# EAGLE design ds-8_clone_V3.0 (EAGLE 5.10)
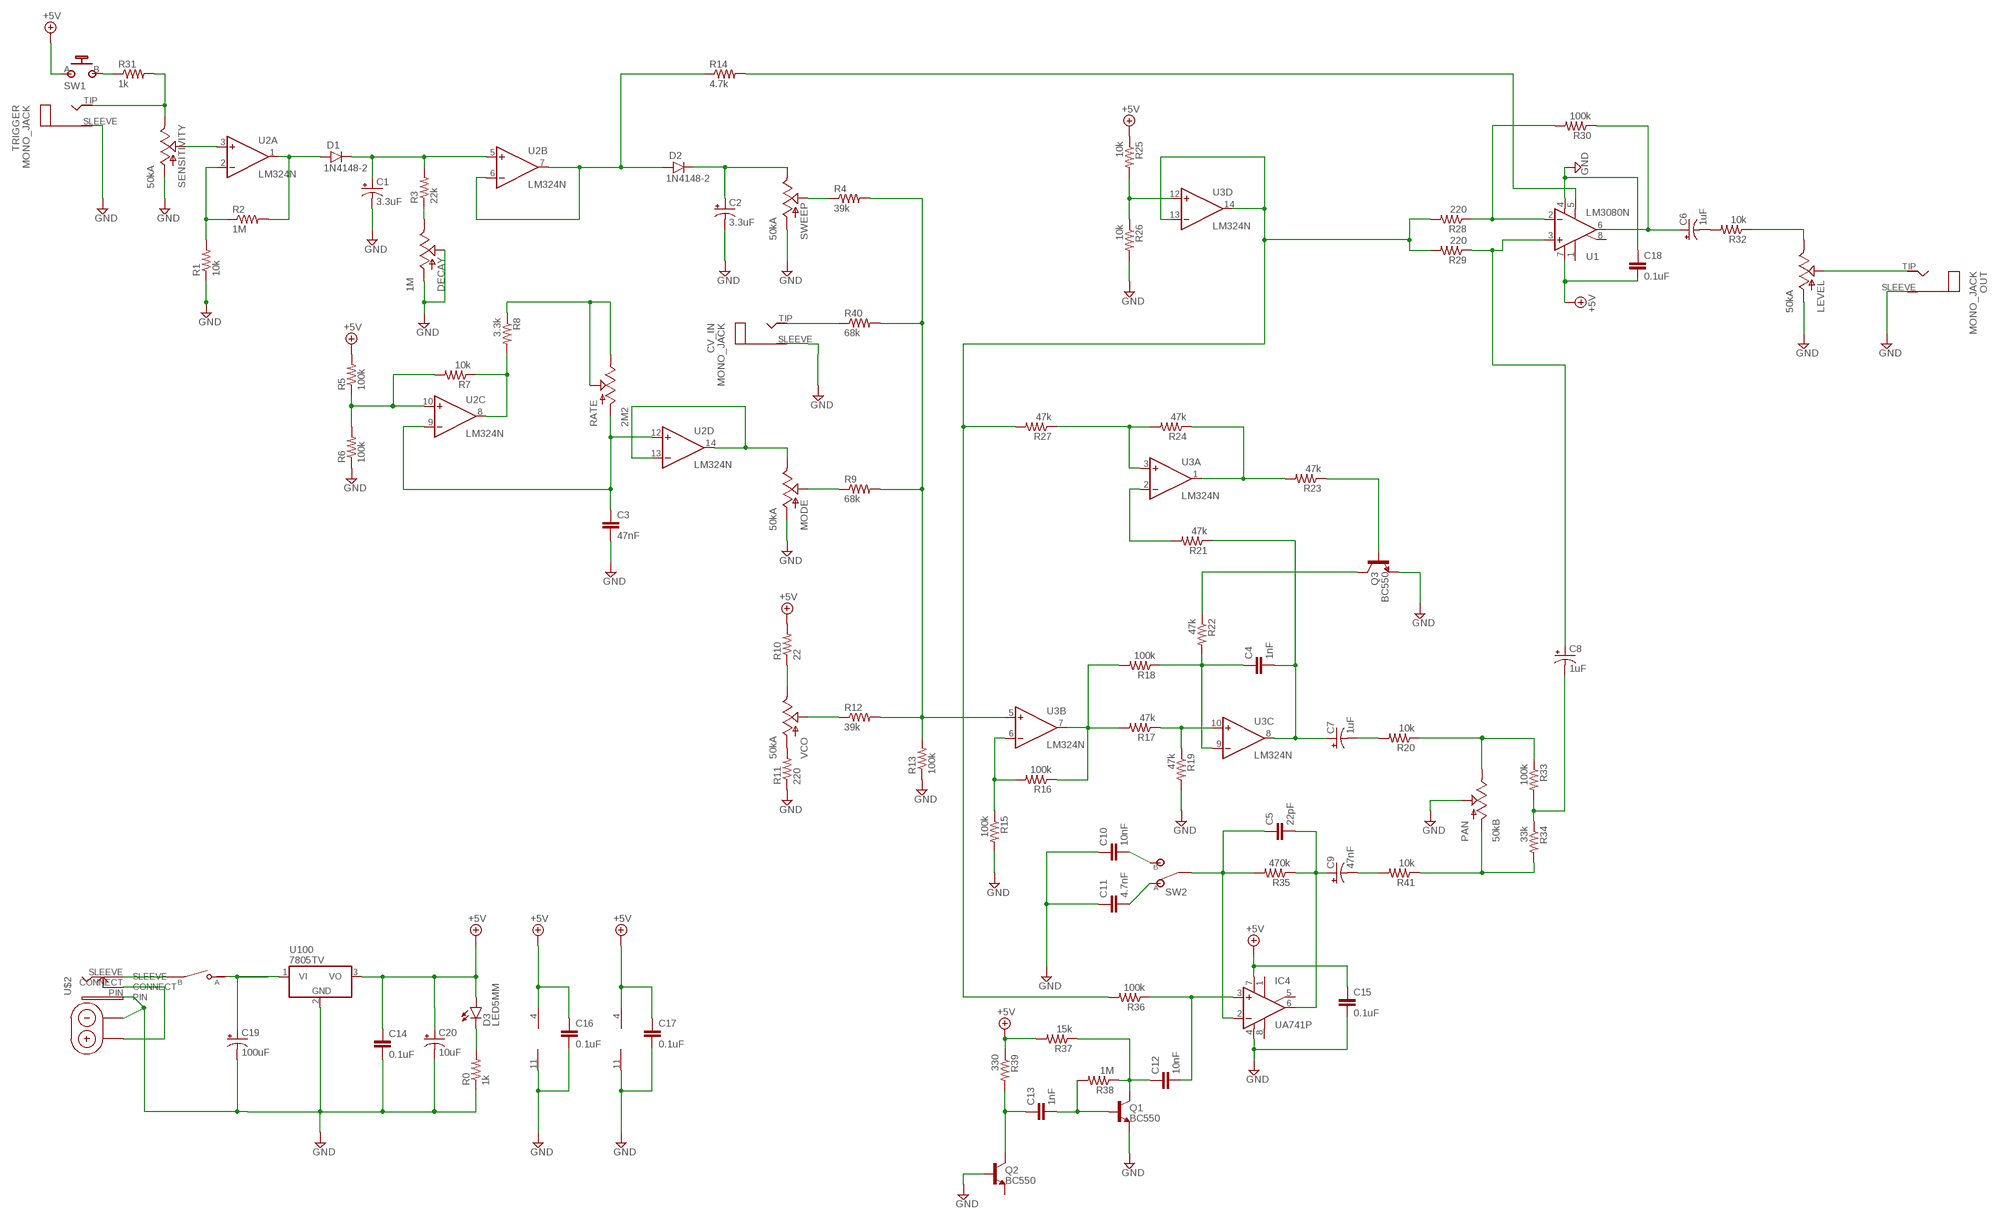
[diagram p0: schematic, sheet 1]

## Parts
C1  3.3uF  0501  [050_020_1]
C2  3.3uF  0501  [050_020_1]
C3  47nF  CERAMIC_CAPACITOR  [CERAMIC_CAP]
C4  1nF  CERAMIC_CAPACITOR  [CERAMIC_CAP]
C5  22pF  CERAMIC_CAPACITOR  [CERAMIC_CAP]
C6  1uF  0501  [050_020_1]
C7  1uF  0501  [050_020_1]
C8  1uF  0501  [050_020_1]
C9  47nF  0501  [050_020_1]
C10  10nF  CERAMIC_CAPACITOR  [CERAMIC_CAP]
C11  4.7nF  CERAMIC_CAPACITOR  [CERAMIC_CAP]
C12  10nF  CERAMIC_CAPACITOR  [CERAMIC_CAP]
C13  1nF  CERAMIC_CAPACITOR  [CERAMIC_CAP]
C14  0.1uF  CERAMIC_CAPACITOR  [CERAMIC_CAP]
C15  0.1uF  CERAMIC_CAPACITOR  [CERAMIC_CAP]
C16  0.1uF  CERAMIC_CAPACITOR  [CERAMIC_CAP]
C17  0.1uF  CERAMIC_CAPACITOR  [CERAMIC_CAP]
C18  0.1uF  CERAMIC_CAPACITOR  [CERAMIC_CAP]
C19  100uF  0501  [050_020_1]
C20  10uF  0501  [050_020_1]
CV_IN  MONO_JACK  [MONO_JACK]
D1  1N4148-2  [DO35-2]
D2  1N4148-2  [DO35-2]
D3  LED5MM  [LED5MM]
DECAY  1M  POT-RV16AF-20  [POT_ALPHA_RV16AF-20]
IC4  UA741P  [DIL08]
LEVEL  50kA  POT-RV16AF-20  [POT_ALPHA_RV16AF-20]
MODE  50kA  POT-RV16AF-20  [POT_ALPHA_RV16AF-20]
OUT  MONO_JACK  [MONO_JACK]
PAN  50kB  POT-RV16AF-20  [POT_ALPHA_RV16AF-20]
Q1  BC550  [TO92-]
Q2  BC550  [TO92-]
Q3  BC550  [TO92-]
R0  1k  RESISTOR  [RESISTOR]
R1  10k  RESISTOR  [RESISTOR]
R2  1M  RESISTOR  [RESISTOR]
R3  22k  RESISTOR  [RESISTOR]
R4  39k  RESISTOR  [RESISTOR]
R5  100k  RESISTOR  [RESISTOR]
R6  100k  RESISTOR  [RESISTOR]
R7  10k  RESISTOR  [RESISTOR]
R8  3.3k  RESISTOR  [RESISTOR]
R9  68k  RESISTOR  [RESISTOR]
R10  22  RESISTOR  [RESISTOR]
R11  220  RESISTOR  [RESISTOR]
R12  39k  RESISTOR  [RESISTOR]
R13  100k  RESISTOR  [RESISTOR]
R14  4.7k  RESISTOR  [RESISTOR]
R15  100k  RESISTOR  [RESISTOR]
R16  100k  RESISTOR  [RESISTOR]
R17  47k  RESISTOR  [RESISTOR]
R18  100k  RESISTOR  [RESISTOR]
R19  47k  RESISTOR  [RESISTOR]
R20  10k  RESISTOR  [RESISTOR]
R21  47k  RESISTOR  [RESISTOR]
R22  47k  RESISTOR  [RESISTOR]
R23  47k  RESISTOR  [RESISTOR]
R24  47k  RESISTOR  [RESISTOR]
R25  10k  RESISTOR  [RESISTOR]
R26  10k  RESISTOR  [RESISTOR]
R27  47k  RESISTOR  [RESISTOR]
R28  220  RESISTOR  [RESISTOR]
R29  220  RESISTOR  [RESISTOR]
R30  100k  RESISTOR  [RESISTOR]
R31  1k  RESISTOR  [RESISTOR]
R32  10k  RESISTOR  [RESISTOR]
R33  100k  RESISTOR  [RESISTOR]
R34  33k  RESISTOR  [RESISTOR]
R35  470k  RESISTOR  [RESISTOR]
R36  100k  RESISTOR  [RESISTOR]
R37  15k  RESISTOR  [RESISTOR]
R38  1M  RESISTOR  [RESISTOR]
R39  330  RESISTOR  [RESISTOR]
R40  68k  RESISTOR  [RESISTOR]
R41  10k  RESISTOR  [RESISTOR]
RATE  2M2  POT-RV16AF-20  [POT_ALPHA_RV16AF-20]
SENSITIVITY  50kA  POT-RV16AF-20  [POT_ALPHA_RV16AF-20]
SW1  MOMENTARY_SW  [MOMENTARY_SW]
SW2  SPDT_SWITCH  [SPDT_TOGGLE_SWITCH]
SW3  SPST_SWITCH  [SPST_TOGGLE_SWITCH]
SWEEP  50kA  POT-RV16AF-20  [POT_ALPHA_RV16AF-20]
TRIGGER  MONO_JACK  [MONO_JACK]
U1  LM3080N  [DIL08]
U2  LM324N  [DIL14]
U3  LM324N  [DIL14]
U100  7805TV  [TO220V]
U$1  9V_BATTERY_CLIP  [9V_BATTERY]
U$2  DC_JACK_OFFBOARD  [DC_JACK_OFFBOARD]
VCO  50kA  POT-RV16AF-20  [POT_ALPHA_RV16AF-20]

## Nets
+9V: C14.1 C15.1 C16.1 C17.1 C18.2 C20.+ D3.A IC4.7(V+) R5.2 R10.2 R25.1 R37.2 R39.1 SW1.A(P) U1.7(V+) U2.4(P:V+) U3.4(P:V+) U100.3(VO) ; supply symbol labelled +5V
C5: C5.1 IC4.2(-IN) R35.2 SW2.C(COM)
GND: C1.- C2.- C3.2 C10.1 C11.1 C14.2 C15.2 C16.2 C17.2 C18.1 C19.- C20.- CV_IN.SLEEVE DECAY.1(A) DECAY.2(S) IC4.4(V-) LEVEL.1(A) MODE.1(A) OUT.SLEEVE PAN.2(S) Q1.1(E) Q2.2(B) Q3.1(E) R0.1 R1.1 R6.1 R11.1 R13.1 R15.2 R19.2 R26.2 SENSITIVITY.1(A) SWEEP.1(A) TRIGGER.SLEEVE U1.4(V-) U2.11(P:V-) U3.11(P:V-) U100.2(GND) U$1.9V_BATTERY_- U$2.PIN
N$1: R31.2 SENSITIVITY.3(E) TRIGGER.TIP
N$2: SW3.B U$2.SLEEVE
N$3: SENSITIVITY.2(S) U2.3(A:+IN)
N$4: R31.1 SW1.B(S)
N$5: R1.2 R2.1 U2.2(A:-IN)
N$6: D1.A R2.2 U2.1(A:OUT)
N$7: C1.+ D1.C R3.2 U2.5(B:+IN)
N$8: D2.A R14.1 U2.6(B:-IN) U2.7(B:OUT)
N$9: DECAY.3(E) R3.1
N$10: U$1.9V_BATTERY_+ U$2.CONNECT
N$11: R14.2 U1.5(OPT)
N$12: R4.1 SWEEP.2(S)
N$13: R25.2 R26.1 U3.12(D:+IN)
N$14: R28.1 R30.2 U1.2(-IN)
N$15: C8.+ R29.1 U1.3(+IN)
N$16: R27.2 R28.2 R29.2 R36.2 U3.13(D:-IN) U3.14(D:OUT)
N$17: CV_IN.TIP R40.1
N$18: C6.+ R30.1 U1.6(OUT)
N$19: R4.2 R9.2 R12.2 R13.2 R40.2 U3.5(B:+IN)
N$20: MODE.2(S) R9.1
N$21: R11.2 VCO.1(A)
N$22: R12.1 VCO.2(S)
N$23: C2.+ D2.C SWEEP.3(E)
N$24: R5.1 R6.2 R7.2 U2.10(C:+IN)
N$25: LEVEL.3(E) R32.1
N$26: R7.1 R8.2 U2.8(C:OUT)
N$27: LEVEL.2(S) OUT.TIP
N$28: R10.1 VCO.3(E)
N$29: R15.1 R16.2 U3.6(B:-IN)
N$30: R16.1 R17.2 R18.2 U3.7(B:OUT)
N$31: R17.1 R19.1 U3.10(C:+IN)
N$32: C4.1 R18.1 R22.2 U3.9(C:-IN)
N$33: C4.2 C7.+ R21.1 U3.8(C:OUT)
N$34: C7.- R20.2
N$35: PAN.3(E) R20.1 R33.1
N$36: C8.- R33.2 R34.1
N$37: MODE.3(E) U2.13(D:-IN) U2.14(D:OUT)
N$38: C9.- R41.2
N$39: C5.2 C9.+ IC4.6(OUT) R35.1
N$40: D3.K(C) R0.2
N$41: C10.2 SW2.B
N$42: C12.2 IC4.3(+IN) R36.1
N$43: C11.2 SW2.A
N$44: C12.1 Q1.3(C) R37.1 R38.1
N$45: C19.+ SW3.A U100.1(VI)
N$46: C13.2 Q1.2(B) R38.2
N$47: C13.1 Q2.3(C) R39.2
N$48: Q3.3(C) R22.1
N$49: R21.2 U3.2(A:-IN)
N$50: Q3.2(B) R23.1
N$51: R23.2 R24.1 U3.1(A:OUT)
N$52: R24.2 R27.1 U3.3(A:+IN)
N$53: C6.- R32.2
N$55: R8.1 RATE.2(S) RATE.3(E)
N$56: C3.1 RATE.1(A) U2.9(C:-IN) U2.12(D:+IN)
R34: PAN.1(A) R34.2 R41.1
Unconnected: IC4.1(ON1) IC4.5(ON2) IC4.8(OPT) Q2.1(E) U1.1(ON1) U1.8(ON2)

## Library data of the parts
C1 C2 C6-C9 C19 C20 = gm-caps-electro-pol:050: 0.22 - 100uF Xicon values at Mouser.com: 10V: 10 - 100uF; 16V: 2.2 - 47uF; 25V: 0.47 - 47uF; 50V: 0.22 - 22uF
C3-C5 C10-C18 = 00_steve:CERAMIC_CAPACITOR
CV_IN OUT TRIGGER = 00_steve:MONO_JACK
D1 D2 = gm-diodes:1N4148: Fast Switching Diode DO-35 glass case a.k.a. 1N914
D3 = gm-diodes:LED
DECAY LEVEL MODE PAN RATE SENSITIVITY SWEEP VCO = SparkFun:POT
IC4 = linear:*741: OP AMP
Q1-Q3 = gm-trans:BC550
R0 R1-R41 = 00_steve:RESISTOR
SW1 = 00_steve:MOMENTARY_SW
SW2 = 00_steve:SPDT_SWITCH: SPDT Switch Part No.: M102 Source: (http://www.led-switch.com)
SW3 = 00_steve:SPST_SWITCH: SPST Switch Part No.: M101 Source: (http://www.led-switch.com)
U1 = gm-ics:*3080: OP AMP
U2 U3 = linear:LM324: OP AMP
U100 = linear:78*: Positive VOLTAGE REGULATOR Source: http://cache.national.com/ds/LM/LM78L05.pdf http://www.fairchildsemi.com/ds/LM/LM7805.pdf
U$1 = 00_steve:9V_BATTERY_CLIP
U$2 = 00_steve:DC_JACK_OFFBOARD

## Board
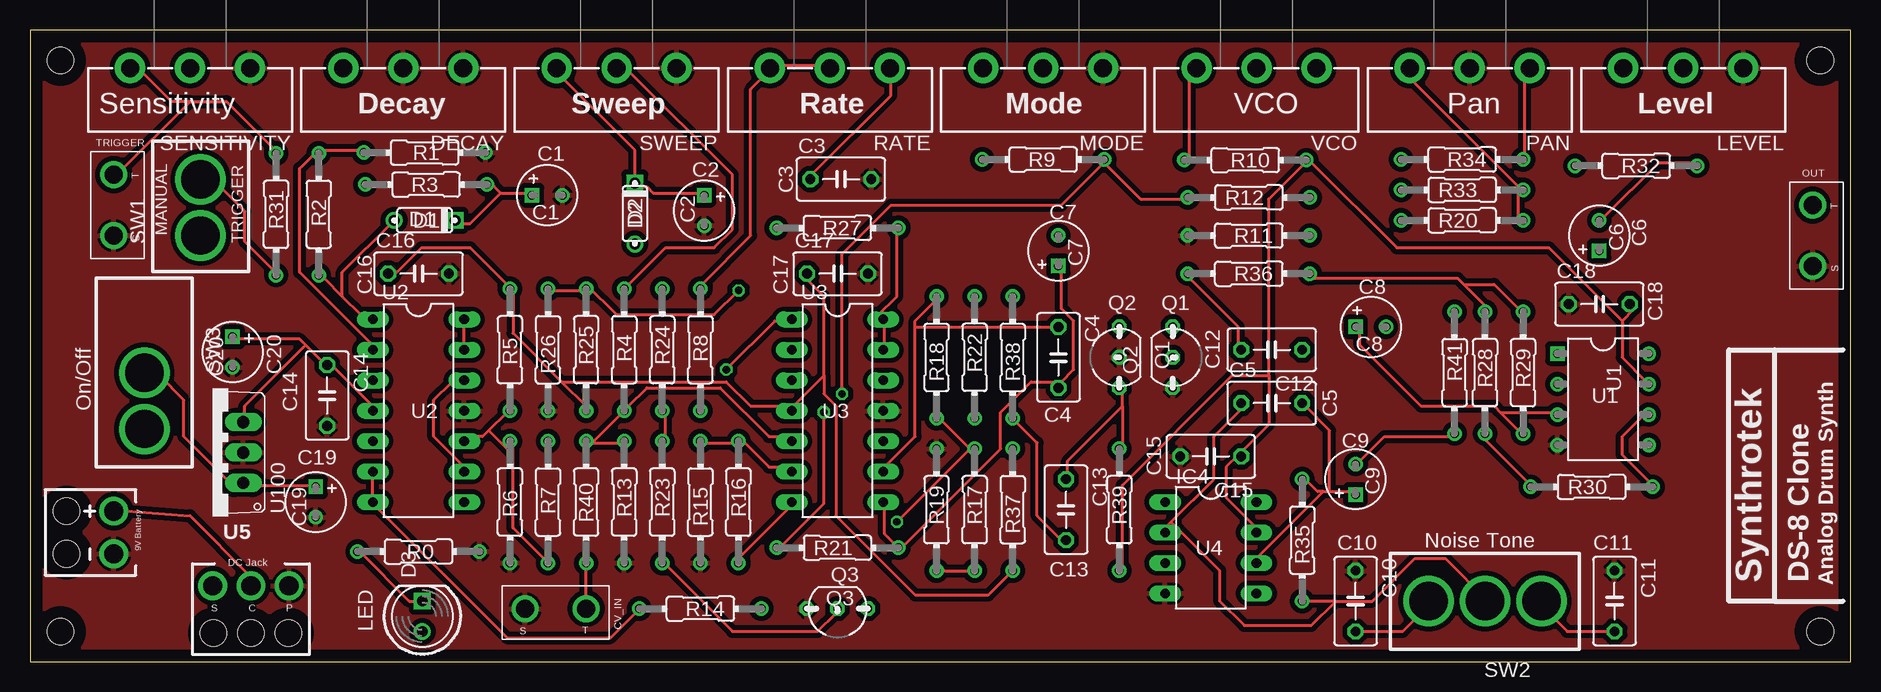
[diagram p1: board, top side]
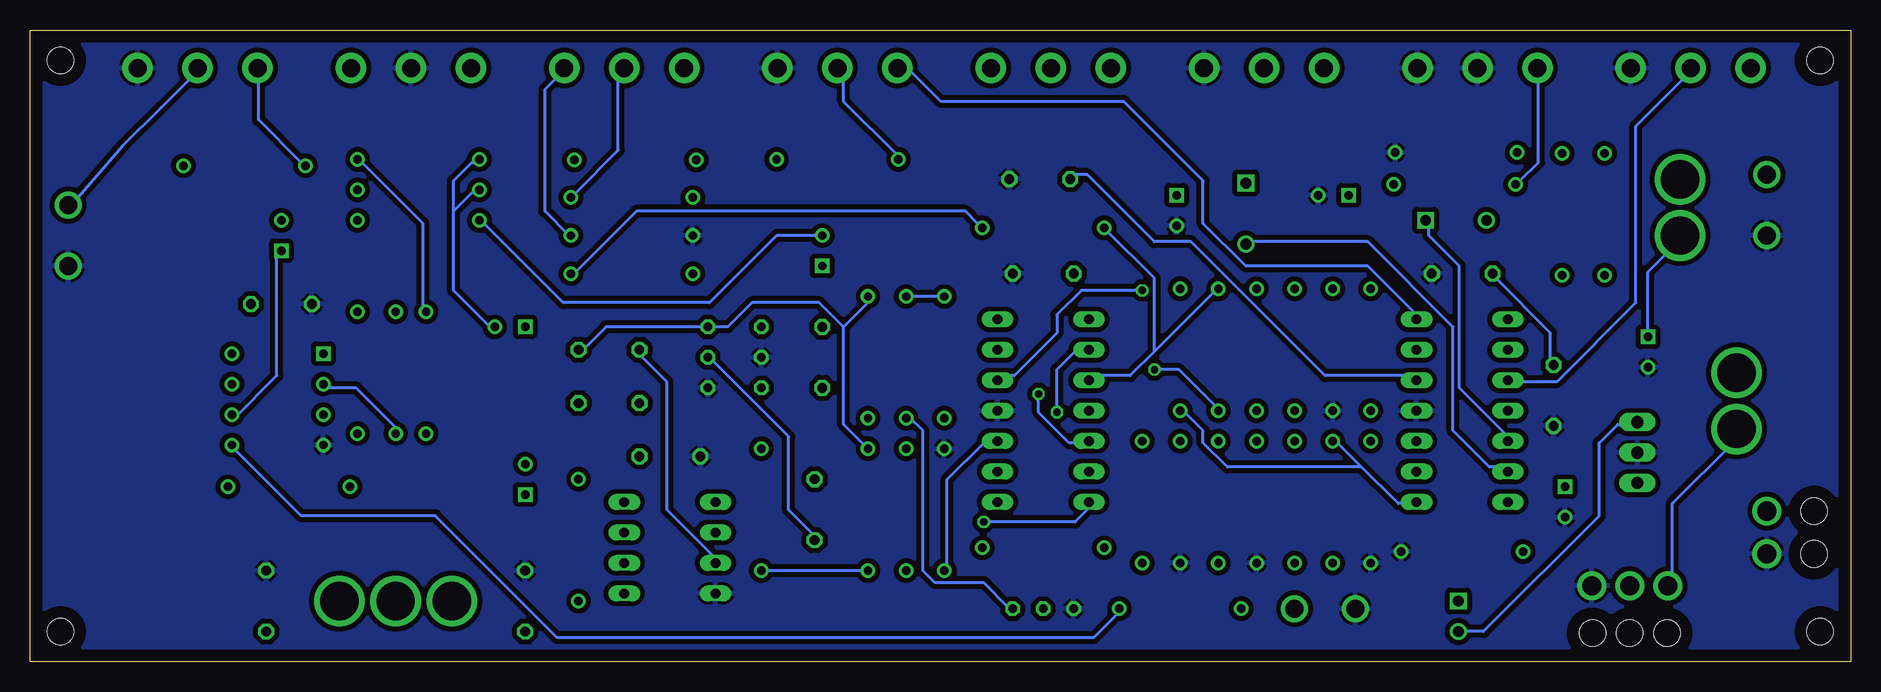
[diagram p2: board, bottom side, seen from below]

Size 151.77 x 52.7 mm. Coordinates in mm from the lower left corner, seen from the top.
Outline: 0,0 151.77,0 151.77,52.7 0,52.7 0,0
Copper layers (1*16): Top 0.035mm / dielectric 1.5mm / Bottom 0.035mm
Design rules "default": minimum track width 10mil, minimum drill 24mil, track to track 8mil, track to pad 8mil, pad to pad 8mil, via to via 8mil, smd to smd 8mil, copper to edge 40mil, drill to drill 8mil, minimum pad ring 10mil, minimum via ring 8mil, stop-mask expansion 4mil, vias tented up to drill 0mil, thermal gap 10mil
Holes 2.2 mm at 2.54,50.16 149.23,50.16 2.54,2.54 149.23,2.54

### Footprints (pad centres in the part's own frame; a part is rotated, then mirrored left to right if it is on the bottom)
050_020_1 = drill 0.7 square: + -1.27,0 | drill 0.7 round: - 1.27,0
CERAMIC_CAP = drill 0.813 octagon: 1 -2.54,0; 2 2.54,0
MONO_JACK = drill 1.5 round: SLEEVE 2.54,0; TIP -2.54,0
DO35-2 = drill 0.9 round: A 2.54,0 | drill 0.9 square: C -2.54,0
LED5MM = drill 0.9 round: A -1.27,0 | drill 0.9 square: K 1.27,0
POT_ALPHA_RV16AF-20 = drill 1.5 pad 2.54 round: 1 -5,0; 2 0,0; 3 5,0
DIL08 = drill 0.813 long: 1 -3.81,-3.81; 2 -1.27,-3.81; 3 1.27,-3.81; 4 3.81,-3.81; 5 3.81,3.81; 6 1.27,3.81; 7 -1.27,3.81; 8 -3.81,3.81
TO92- = drill 0.7 octagon: 1 2.54,0; 2 0,0; 3 -2.54,0
RESISTOR = drill 0.7 round: 1 -5.08,0; 2 5.08,0
MOMENTARY_SW = drill 3.2 round: A -2.223,0.064; B 2.478,0.064
SPDT_TOGGLE_SWITCH = drill 3.2 round: A -4.7,0; B 4.7,0; C 0,0
SPST_TOGGLE_SWITCH = drill 3.2 round: A 0,0; B 4.7,0
DIL08' = drill 0.7 square: 1 -3.81,-3.81 | drill 0.7 round: 2 -1.27,-3.81; 3 1.27,-3.81; 4 3.81,-3.81; 5 3.81,3.81; 6 1.27,3.81; 7 -1.27,3.81; 8 -3.81,3.81
DIL14 = drill 0.813 long: 1 -7.62,-3.81; 2 -5.08,-3.81; 3 -2.54,-3.81; 4 0,-3.81; 5 2.54,-3.81; 6 5.08,-3.81; 7 7.62,-3.81; 8 7.62,3.81; 9 5.08,3.81; 10 2.54,3.81; 11 0,3.81; 12 -2.54,3.81; 13 -5.08,3.81; 14 -7.62,3.81
TO220V = drill 1.016 long: 1 -2.54,-2.54; 2 0,-2.54; 3 2.54,-2.54
9V_BATTERY = drill 1.6 round: 9V_BATTERY_+ -1.778,1.27; 9V_BATTERY_- 1.778,1.27 | hole 2.2: -1.778,-2.667; 1.778,-2.667
DC_JACK_OFFBOARD = drill 1.6 round: CONNECT 0,1.27; PIN 3.175,1.27; SLEEVE -3.175,1.27 | hole 2.2: -3.111,-2.667; 0,-2.667; 3.111,-2.667

### Placement (x,y rotation side)
C1  43.12,38.93 0 top
C2  56.2,37.66 270 top
C3  67.59,40.26 0 top
C4  85.72,25.4 270 top
C5  103.5,21.59 0 top
C6  130.81,35.56 90 top
C7  85.72,34.29 90 top
C8  111.76,27.94 0 top
C9  110.49,15.24 90 top
C10  110.49,5.08 270 top
C11  132.08,5.08 270 top
C12  103.5,26.04 180 top
C13  86.36,12.7 270 top
C14  24.77,22.23 270 top
C15  98.42,17.14 180 top
C16  32.38,32.38 0 top
C17  67.31,32.38 0 top
C18  130.81,29.84 0 top
C19  23.81,13.34 270 top
C20  16.89,25.84 270 top
CV_IN  43.81,4.45 180 top
D1  32.89,36.83 180 top
D2  50.42,37.4 270 top
D3  32.7,3.81 90 top
DECAY  31.12,49.53 180 top
IC4  98.42,9.53 270 top
LEVEL  137.8,49.53 180 top
MODE  84.45,49.53 180 top
OUT  148.59,35.56 270 top
PAN  120.02,49.53 180 top
Q1  95.25,25.4 270 top
Q2  90.8,25.4 90 top
Q3  67.31,4.45 180 top
R0  32.38,9.21 180 top
R1  32.89,42.48 180 top
R2  24.07,37.34 270 top
R3  33.02,39.81 0 top
R4  49.53,26.04 270 top
R5  40,26.04 90 top
R6  40,13.34 90 top
R7  43.18,13.34 270 top
R8  55.88,26.04 270 top
R9  84.45,41.91 0 top
R10  101.31,41.86 0 top
R11  101.6,35.56 0 top
R12  101.6,38.73 180 top
R13  49.53,13.34 90 top
R14  55.88,4.45 0 top
R15  55.88,13.34 270 top
R16  59.05,13.34 90 top
R17  78.74,12.7 90 top
R18  75.56,25.4 270 top
R19  75.56,12.7 90 top
R20  119.38,36.83 180 top
R21  67.31,9.53 180 top
R22  78.74,25.4 90 top
R23  52.7,13.34 90 top
R24  52.7,26.04 90 top
R25  46.35,26.04 90 top
R26  43.18,26.04 270 top
R27  67.31,36.2 0 top
R28  121.28,24.13 90 top
R29  124.46,24.13 90 top
R30  130.18,14.61 180 top
R31  20.51,37.34 90 top
R32  133.89,41.38 0 top
R33  119.38,39.37 180 top
R34  119.38,41.91 0 top
R35  106.05,10.16 270 top
R36  101.6,32.38 0 top
R37  81.91,12.7 270 top
R38  81.91,25.4 270 top
R39  90.8,12.7 90 top
R40  46.35,13.34 90 top
R41  118.74,24.13 270 top
RATE  66.67,49.53 180 top
SENSITIVITY  13.34,49.53 180 top
SW1  14.29,37.78 90 top
SW2  121.28,5.08 180 top
SW3  9.52,24.13 270 top
SWEEP  48.89,49.53 180 top
TRIGGER  6.98,38.1 270 top
U1  LM3080N  [DIL08']  131.13,21.91 270 top
U2  32.38,20.95 270 top
U3  67.31,20.95 270 top
U100  15.24,17.46 90 top
U$1  5.71,10.79 270 top
U$2  18.41,5.08 0 top
VCO  102.23,49.53 180 top

### Tracks (layer width: path | path; a pad name or v marks a point on that pad's centre or on a via)
+9V
  Top 0.254: 132.72,28.45 132.72,25.4 134.75,23.37 U1.7 | 132.72,28.45 133.73,29.46 C18.2 | 103.25,23.88 103.25,19.81 100.71,17.27 | 103.25,23.88 103.25,38.61 106.3,41.66 R10.2 106.81,41.66 113.92,34.54 126.62,34.54 132.72,28.45 | 100.71,17.27 C15.1 100.71,17.27 | 100.71,17.27 99.69,16.26 99.69,13.72 102.23,11.18 IC4.7 | 103.25,23.88 100.2,23.88 91.06,14.73 91.06,7.62 R39.1 | 66.17,23.88 63.63,21.34 U3.4 63.12,21.34 60.07,21.34 58.04,23.37 44.32,23.37 | 66.17,23.88 66.17,30.48 64.64,32 C17.1 | C16.1 30.1,32 32.64,34.54 36.7,34.54 39.75,31.5 R5.2 40.26,30.99 40.26,27.43 44.32,23.37 | 44.32,23.37 46.35,21.34 R25.1 | U2.4 28.57,21.34 25.02,24.89 C14.1 24.51,24.89 22.99,26.42 | 22.99,26.42 22.48,26.92 16.89,26.92 C20.+ | 22.99,26.42 17.91,21.34 17.91,20.32 U100.3 | R37.2 79.88,5.59 73.79,5.59 67.18,12.19 67.18,21.34 66.17,22.35 66.17,23.88
  Bottom 0.254: R37.2 90.55,7.62 R39.1 | D3.A 32.64,2.54 30.61,2.54 20.96,12.19 20.96,18.29 19.43,19.81 17.91,19.81 U100.3 | C20.+ 16.89,27.43 16.89,32.51 13.84,35.56 SW1.A | C16.1 29.59,32 25.02,27.43 25.02,24.89 C14.1
C5
  Top 0.254: 95.12,11.68 98.68,15.24 98.68,18.8 101.22,21.34 C5.1 | 95.12,11.68 94.61,11.18 IC4.2 | 108.84,5.08 111.89,5.08 115.44,8.64 117.98,8.64 121.54,5.08 SW2.C | 108.84,5.08 106.3,5.08 R35.2 | 95.12,11.68 99.19,7.62 99.19,5.08 101.22,3.05 106.81,3.05 108.84,5.08
GND
  pour Top (isolate 0.406): 0,52.7 151.77,52.7 151.77,0 0,0
  pour Bottom (isolate 0.406): 0,52.7 151.77,52.7 151.77,0 0,0
N$1
  Top 0.254: 13.34,46.74 11.81,46.74 8.76,49.78 SENSITIVITY.3 | 13.34,46.74 16.38,46.74 20.45,42.67 R31.2 | 13.34,46.74 7.24,40.64 TRIGGER.TIP
N$2
  Bottom 0.254: U$2.SLEEVE 14.86,6.6 14.86,13.21 9.78,18.29 9.78,19.3 SW3.B
N$3
  Bottom 0.254: U2.3 28.57,23.37 24.51,23.37 17.91,29.97 17.91,44.7 13.34,49.28 SENSITIVITY.2
N$4
  Top 0.254: R31.1 20.45,32.51 17.91,35.05 17.91,37.59 15.37,40.13 14.35,40.13 SW1.B
N$5
  Top 0.254: R1.2 27.56,42.67 24.51,42.67 R2.1 24,42.67 22.48,41.15 22.48,32.51 28.57,26.42 U2.2
N$6
  Top 0.254: 26.04,30.48 27.56,28.96 28.57,28.96 U2.1 | 26.04,30.48 24.51,32 R2.2 | 26.04,30.48 26.04,32.51 30.1,36.58 D1.A
N$7
  Top 0.254: 39.24,39.12 41.78,39.12 C1.+ | 39.24,39.12 38.23,40.13 R3.2 | 39.24,39.12 36.7,36.58 35.69,36.58 D1.C
  Bottom 0.254: U2.5 28.57,18.8 32.64,22.86 32.64,33.02 35.18,35.56 35.18,36.58 D1.C
N$8
  Top 0.254: R14.1 50.42,4.06 48.39,2.03 39.75,2.03 28.57,13.21 U2.7 28.57,13.72 28.57,15.75 U2.6
  Bottom 0.254: D2.A 50.42,35.05 40.26,35.05 33.15,27.94 33.15,19.3 30.1,16.26 28.57,16.26 U2.6
N$9
  Bottom 0.254: R3.1 27.56,40.13 26.04,41.66 26.04,49.28 DECAY.3
N$10
  Top 0.254: U$1.9V_BATTERY_+ 6.98,12.7 13.34,12.19 18.41,7.11 18.41,6.6 U$2.CONNECT
N$11
  Bottom 0.254: R14.2 61.09,4.06 63.12,2.03 107.82,2.03 117.98,12.19 129.16,12.19 134.75,17.78 U1.5
N$12
  Top 0.254: R4.1 49.91,31.5 52.96,34.54 57.02,34.54 58.55,36.07 58.55,40.64 49.91,49.28 48.89,49.28 SWEEP.2
N$13  (via drill 0.61)
  Top 0.254: R26.1 43.31,30.99 46.35,30.99 R25.2 46.35,31.5 48.89,28.96 57.02,28.96 v59.05,30.99
  Bottom 0.254: v59.05,30.99 64.14,30.99 66.17,28.96 66.17,27.43 69.72,23.88 70.74,23.88 U3.12
N$14
  Top 0.254: R30.2 125.09,14.73 121.03,18.8 R28.1
  Bottom 0.254: U1.2 127.13,22.86 124.59,22.86 121.03,19.3 R28.1
N$15
  Top 0.254: 122.55,20.83 124.08,19.3 R29.1 | 122.55,20.83 122.05,21.34 115.95,21.34 110.87,26.42 110.87,27.94 C8.+ | 122.55,20.83 127.13,20.83 U1.3
N$16
  Top 0.254: R27.2 72.26,36.07 72.26,30.48 70.74,28.96 U3.14 71.25,28.45 71.25,26.42 U3.13 | 119.51,31.5 121.54,29.46 R28.2 | 119.51,31.5 119,32 106.81,32 R36.2 | 119.51,31.5 122.05,31.5 124.08,29.46 R29.2
  Bottom 0.254: R27.2 72.77,36.58 73.79,37.59 101.22,37.59 106.3,32.51 R36.2
N$17
  Top 0.254: R40.1 46.35,8.13 46.35,4.57 CV_IN.TIP
N$18
  Top 0.254: R30.1 135.26,14.73 132.72,17.27 132.72,18.8 134.75,20.83 U1.6
  Bottom 0.254: C6.+ 131.19,34.04 131.19,23.88 134.75,20.32 U1.6
N$19  (via drill 0.61)
  Top 0.254: 89.53,41.66 92.58,38.61 96.14,38.61 R12.2 | 89.53,41.66 R9.2 89.53,41.66 | 46.86,18.29 49.4,18.29 R13.2 | 46.86,18.29 46.35,18.29 R40.2 46.86,18.29 | 46.86,18.29 49.4,20.83 R4.2 49.91,21.34 51.43,22.86 57.53,22.86 61.59,18.8 63.12,18.8 U3.5 | 89.53,41.66 85.98,38.1 71.75,38.1 67.69,34.04 v67.69,22.35
  Bottom 0.254: v67.69,22.35 67.69,20.83 65.15,18.29 63.63,18.29 U3.5
N$20
  Bottom 0.254: R9.1 79.38,42.16 83.95,46.74 83.95,48.77 84.45,49.28 MODE.2
N$21
  Bottom 0.254: R11.2 106.81,35.56 108.84,37.59 108.84,47.75 107.31,49.28 VCO.1
N$22
  Bottom 0.254: R12.1 106.3,39.12 102.74,42.67 102.74,48.77 102.23,49.28 VCO.2
N$23
  Top 0.254: C2.+ 56.01,39.12 51.94,39.12 51.43,39.62 50.42,39.62 D2.C 50.42,40.13 50.42,42.67 43.81,49.28 SWEEP.3
N$24
  Top 0.254: 38.23,19.3 37.72,18.8 36.2,18.8 U2.10 | 38.23,19.3 39.75,20.83 R5.1 | 40.26,17.27 40.26,18.29 R6.2 | 40.26,17.27 40.26,11.18 42.8,8.64 R7.2 | 40.26,17.27 38.23,19.3
N$25
  Bottom 0.254: R32.1 129.16,41.66 132.72,45.21 132.72,49.28 LEVEL.3
N$26
  Bottom 0.254: 40.77,16.26 37.72,13.21 36.2,13.21 U2.8 | 40.77,16.26 42.8,18.29 R7.1 | 40.77,16.26 51.94,16.26 53.97,18.29 53.97,19.3 55.5,20.83 R8.2
N$27
  Bottom 0.254: OUT.TIP 148.34,38.1 144.02,43.05 140.84,46.23 137.8,49.28 LEVEL.2
N$28
  Top 0.254: R10.1 96.65,42.16 96.65,48.77 97.16,49.28 VCO.3
N$29
  Top 0.254: R15.1 56.01,18.29 59.05,18.29 R16.2 59.05,18.8 61.59,16.26 63.12,16.26 U3.6
N$30  (via drill 0.61)
  Top 0.254: 78.36,17.78 75.82,20.32 R18.2 | 78.36,17.78 R17.2 78.36,17.78 | R16.1 59.05,8.64 63.63,13.21 U3.7 | v72.26,11.68 78.36,17.78
  Bottom 0.254: v72.26,11.68 64.64,11.68 63.12,13.21 U3.7
N$31
  Top 0.254: R19.1 75.82,7.62 78.36,7.62 R17.1
  Bottom 0.254: U3.10 71.25,18.29 72.26,18.29 75.31,15.24 75.31,7.62 R19.1
N$32
  Top 0.254: 73.79,27.94 73.79,28.45 75.82,30.48 R18.1 | 73.79,27.94 73.79,18.8 71.25,16.26 U3.9 | 73.79,27.94 85.47,27.94 C4.1
  Bottom 0.254: R18.1 75.82,30.48 78.36,30.48 R22.2
N$33
  Top 0.254: U3.8 71.25,13.21 71.25,10.67 72.26,9.65 R21.1 72.77,9.65 80.9,17.78 80.9,20.83 83.44,23.37 85.98,23.37 | 85.98,23.37 85.47,22.86 C4.2 85.98,23.37 | 85.98,23.37 86.99,24.38 86.99,28.45 85.98,29.46 85.98,33.02 C7.+
N$34
  Bottom 0.254: C7.- 85.98,35.56 89.53,35.56 95.12,29.97 107.31,29.97 113.92,36.58 R20.2
N$35
  Top 0.254: R20.1 124.08,37.08 124.08,39.12 R33.1 124.08,39.62 115.44,48.26 115.44,49.28 PAN.3
N$36
  Bottom 0.254: 116.46,37.59 116.46,30.99 113.41,27.94 C8.- | 116.46,37.59 114.43,39.62 R33.2 | 116.46,37.59 116.46,40.13 114.94,41.66 114.43,41.66 R34.1
N$37
  Top 0.254: U2.13 36.2,26.42 36.2,28.45 U2.14
  Bottom 0.254: U2.14 36.2,28.96 40.26,33.02 50.42,33.02 53.97,36.58 53.97,40.13 60.58,46.74 75.82,46.74 78.36,49.28 79.38,49.28 MODE.3
N$38
  Top 0.254: C9.- 110.87,16.76 112.9,18.8 118.49,18.8 R41.2
N$39
  Top 0.254: 108.33,14.22 110.36,14.22 C9.+ | 107.82,14.22 108.33,14.22 | 107.82,14.22 107.31,14.22 106.3,15.24 R35.1 | 107.82,14.22 102.23,8.64 IC4.6 | 108.33,14.22 108.33,19.3 106.3,21.34 C5.2
N$40
  Top 0.254: R0.2 27.56,9.14 31.62,5.08 32.64,5.08 D3.K
N$41
  Top 0.254: C10.2 110.87,2.54 114.43,2.54 116.97,5.08 SW2.B
N$42
  Top 0.254: R36.1 96.65,32 100.71,27.94 100.71,26.42 C12.2
  Bottom 0.254: IC4.3 94.61,8.64 98.68,12.7 98.68,23.37 101.22,25.91 C12.2
N$43
  Top 0.254: C11.2 131.7,2.54 128.14,2.54 125.6,5.08 SW2.A
N$44
  Bottom 0.254: C12.1 105.79,25.91 103.76,27.94 95.63,27.94 Q1.3 95.12,27.94 93.6,27.94 91.57,29.97 85.98,29.97 83.95,27.94 | R37.1 83.95,19.81 83.95,27.94 | 83.95,27.94 81.91,29.97 R38.1
N$45
  Top 0.254: C19.+ 23.5,14.73 17.91,14.73 U100.1 17.4,15.24 16.38,15.24 12.83,18.8 12.83,21.84 10.79,23.88 9.78,23.88 SW3.A
N$46
  Top 0.254: R38.2 83.95,18.29 83.95,12.19 85.98,10.16 C13.2
  Bottom 0.254: Q1.2 95.12,25.4 88.52,18.8 88.52,12.7 85.98,10.16 C13.2
N$47
  Top 0.254: 91.06,21.34 91.06,22.86 Q2.3 | 91.06,21.34 91.06,17.78 R39.2 | 91.06,21.34 86.49,16.76 86.49,15.24 C13.1
N$48
  Bottom 0.254: Q3.3 70.23,4.57 72.26,6.6 76.33,6.6 77.34,7.62 77.34,19.3 78.36,20.32 R22.1
N$49  (via drill 0.61)
  Top 0.254: v66.17,20.83 66.17,13.21 62.61,9.65 R21.2
  Bottom 0.254: v66.17,20.83 66.17,24.38 64.64,25.91 63.63,25.91 U3.2
N$50
  Top 0.254: R23.1 52.96,8.13 58.55,2.54 65.66,2.54 67.18,4.06 Q3.2
N$51  (via drill 0.61)
  Top 0.254: R23.2 52.96,18.8 52.96,20.83 R24.1 | v58.04,24.38 62.1,28.45 63.12,28.45 U3.1
  Bottom 0.254: v58.04,24.38 56.01,24.38 52.96,21.34 R24.1
N$52
  Bottom 0.254: 58.04,25.91 60.07,23.88 63.12,23.88 U3.3 | 58.04,25.91 52.96,30.99 R24.2 | 58.04,25.91 58.04,32 62.1,36.07 R27.1
N$53
  Top 0.254: C6.- 131.19,37.08 135.76,41.66 138.81,41.66 R32.2
N$55
  Top 0.254: R8.1 56.01,31.5 60.07,35.56 60.07,47.75 61.59,49.28 RATE.3 62.1,49.78 66.67,49.78 RATE.2
N$56
  Top 0.254: U2.9 36.2,16.26 33.66,18.8 33.66,21.84 35.18,23.37 36.2,23.37 U2.12 | C3.1 65.15,40.64 71.75,47.24 71.75,49.28 RATE.1
  Bottom 0.254: U2.12 36.2,23.88 43.81,23.88 54.99,35.05 58.04,35.05 63.63,40.64 64.64,40.64 C3.1
R34
  Top 0.254: PAN.1 124.59,49.28 124.59,42.16 R34.2
  Bottom 0.254: R41.1 119,29.46 119,36.58 124.08,41.66 R34.2

### Text on the board
tPlace: Sensitivity | Decay | Sweep | Rate | Mode | VCO | Pan | Level | C1 | C2 | C3 | D1 | C7 | MANUAL | D2 | TRIGGER | C6 | C16 | C17 | C8 | Q2 | Q1 | C18 | C20 | C12 | U1 | On/Off | C14 | U2 | U3 | C4 | C5 | C9 | C19 | C15 | U5 | Noise Tone | U4 | C10 | C11 | Q3 | C13 | Synthrotek | DS-8 Clone | Analog Drum Synth | LED